# Altium schematic sheet Outputs.SchDoc
size A; SheetNumber: 8; SheetTotal: 10
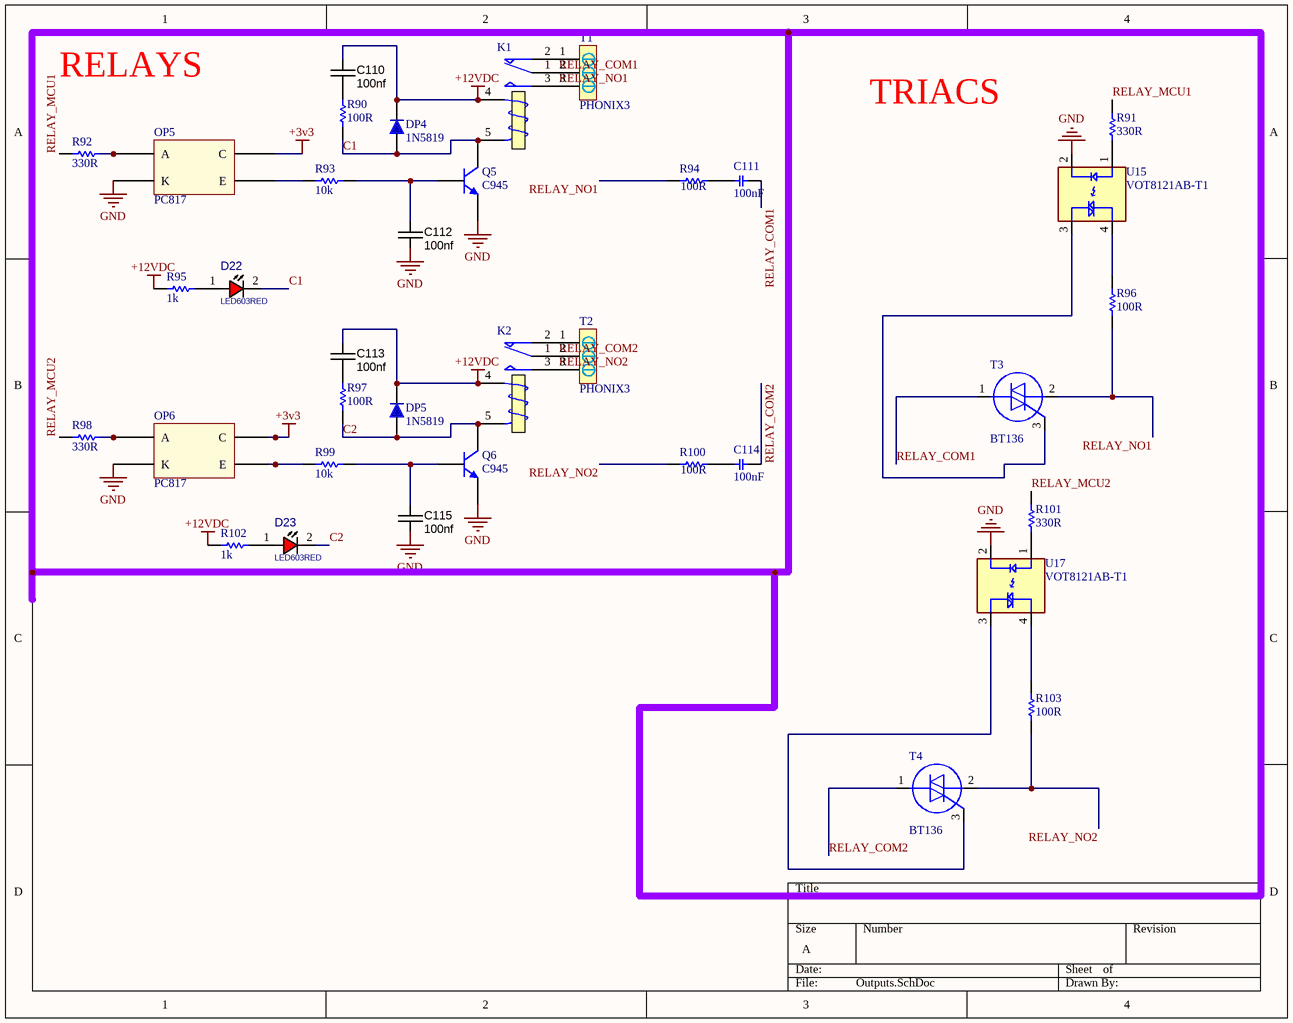
[diagram p0: Outputs.SchDoc]

## Parts
C110  100nf  [CAPC1608X90N]
C111  100nF  [Cap - 10nF - 630V]
C112  100nf  [CAPC1608X90N]
C113  100nf  [CAPC1608X90N]
C114  100nF  [Cap - 10nF - 630V]
C115  100nf  [CAPC1608X90N]
D22  LED603RED  [LED0603RED]
D23  LED603RED  [LED0603RED]
DP4  1N5819  [430X270D]
DP5  1N5819  [430X270D]
K1  (no value)  [Relay 18.85x15.35x15.70]
K2  (no value)  [Relay 18.85x15.35x15.70]
OP5  PC817  [PC817 SMD]
OP6  PC817  [PC817 SMD]
Q5  C945  [SOT23_N]
Q6  C945  [SOT23_N]
R90  100R  [Resistor_SMD_0603 (1608)]
R91  330R  [Resistor_SMD_0603 (1608)]
R92  330R  [Resistor_SMD_0603 (1608)]
R93  10k  [Resistor_SMD_0603 (1608)]
R94  100R  [RES2512]
R95  1k  [Resistor_SMD_0603 (1608)]
R96  100R  [RES2512]
R97  100R  [Resistor_SMD_0603 (1608)]
R98  330R  [Resistor_SMD_0603 (1608)]
R99  10k  [Resistor_SMD_0603 (1608)]
R100  100R  [RES2512]
R101  330R  [Resistor_SMD_0603 (1608)]
R102  1k  [Resistor_SMD_0603 (1608)]
R103  100R  [RES2512]
T1  PHONIX3  [PHONIX3]
T2  PHONIX3  [PHONIX3]
T3  BT136  [TO252]
T4  BT136  [TO252]
U15  VOT8121AB-T1  [SOIC254P1016X440-4N]
U17  VOT8121AB-T1  [SOIC254P1016X440-4N]

## Nets
+3v3: OP5.4(C) OP6.4(C)
+12VDC: C110.2 C113.2 DP4.2 DP5.2 K1.4(T1) K2.4(T1) R95.1 R102.1
GND: C112.1 C115.1 OP5.2(K) OP6.2(K) Q5.2(E) Q6.2(E) U15.2(C) U17.2(C)
C1: D22.2(CATHODE) DP4.1 K1.5(T2) Q5.3(C) R90.2
C2: D23.2(CATHODE) DP5.1 K2.5(T2) Q6.3(C) R97.2
RELAY_COM1: C111.1 K1.1(COM) T1.2 T3.1(MT1)
RELAY_COM2: C114.1 K2.1(COM) T2.2 T4.1(MT1)
RELAY_MCU1: R91.1 R92.1
RELAY_MCU2: R98.1 R101.1
RELAY_NO1: K1.3(NO) R94.2 R96.1 T1.3 T3.2(MT2)
RELAY_NO2: K2.3(NO) R100.2 R103.1 T2.3 T4.2(MT2)
NetC110_1: C110.1 R90.1
NetC111_2: C111.2 R94.1
NetC112_2: C112.2 Q5.1(B) R93.2
NetC113_1: C113.1 R97.1
NetC114_2: C114.2 R100.1
NetC115_2: C115.2 Q6.1(B) R99.2
NetD22_1: D22.1(ANODE) R95.2
NetD23_1: D23.1(ANODE) R102.2
NetK1_2: K1.2(NC) T1.1
NetK2_2: K2.2(NC) T2.1
NetOP5_1: OP5.1(A) R92.2
NetOP5_3: OP5.3(E) R93.1
NetOP6_1: OP6.1(A) R98.2
NetOP6_3: OP6.3(E) R99.1
NetR91_2: R91.2 U15.1(A)
NetR96_2: R96.2 U15.4(MT2)
NetR101_2: R101.2 U17.1(A)
NetR103_2: R103.2 U17.4(MT2)
NetT3_3: T3.3(G) U15.3(MT1)
NetT4_3: T4.3(G) U17.3(MT1)

## Notes on the sheet
- RELAYS
- TRIACS

## Library data of the parts
C110 C112 C113 C115 = CAPC_100n_0603_X7R_50V_10%: Capacitor SMD Cer 100nF 10% 50V X7R 0603; Manufacturer 1: AVX Corporation; Manufacturer Part Number 1: 06035C104KAT2A; Ratings: 50V; X7R; Material: ceramic; SCDType: spec; Value: 100n; Manufacturer 2: TDK Corporation; Manufacturer Part Number 2: C1608X7R1H104K; Package / Case: 0603 (1608 Metric); Tolerance: ±10%; Supplier 1: Digi-Key; Supplier Part Number 1: 478-5052-1-ND; ComponentLink1URL: http://www.avx.com/docs/Catalogs/cx7r.pdf; ComponentLink1Description: http://www.avx.com/docs/Catalogs/cx7r.pdf; Supplier 2: Digi-Key; Supplier Part Number 2: 445-1314-1-ND; ComponentLink2URL: http://product.tdk.com/capacitor/mlcc/en/documents/mlcc_commercial_general_en.pdf; ComponentLink2Description: http://product.tdk.com/capacitor/mlcc/en/documents/mlcc_commercial_general_en.pdf
C111 C114 = Capacitor Polyester THD: DatasheetVersion: 2021; ComponentLink1Description: Website Smart World; ComponentLink1URL: https://www.smartw.ir/; ComponentLink2Description: Telegram; ComponentLink2URL: https://t.me/altium_smartw; ComponentLink3Description: Instagram; ComponentLink3URL: https://Instagram.com/smartgw.ir; Value: 100nF
D22 D23 = LED_SMD_0603_RED: LED, SMD, 0603, RED; PARAM: 30mA, 640nm; DESC: DESCRIPTION; MANF_P#: MANF_PART#; PARAM2: 1.8~2.5V; MANF: MANF; ASSEMBLY: ASSEMBLY; PRICE: PRICE; VALUE: LED603RED
DP4 DP5 = 1N5819: Schottkey Rectifiers; Designer: Abbas Basereh; Data: 16-12-2016; Link: *; Part. No: *
K1 K2 = Relay_SPDT: Single-Pole Dual-Throw Relay; Designer: Abbas Basereh; Mounting Technology: Through-Hole; ComponentLink1Description: Datasheet; Pin Count: 0; Update Date: 2017-3-1
OP5 OP6 = PC817: PC817 optocpler; ComponentLink2Description: Website Smart World; ComponentLink2URL: https://www.smartw.ir/; ComponentLink3Description: Telegram; ComponentLink3URL: https://t.me/altium_smartw; ComponentLink4Description: Instagram; ComponentLink4URL: https://Instagram.com/smartgw.ir; DatasheetVersion: 2021
Q5 Q6 = C945: NPN Silicon Epitaxial Planar Transistor; Published: 2017-2-8; LatestRevisionDate: 2017; LatestRevisionNote: IPC-7351 Footprint Added.; DatasheetVersion: 2017; PackageVersion: 2017-2-8; PackageReference: SOT23; Publisher: Abbas Basereh; PackageDescription: 3-Pin SOT-23 Package 0.95 mm Pitch, 2.3 mm Lead Span; ComponentLink1Description: Manufacturer Link; ComponentLink1URL: http://www.taitroncomponents.com/; ComponentLink2Description: Datasheet; ComponentLink2URL: http://www.taitroncomponents.com/
R90 = Resistor: Resistor 0603; Email: razi.vesali@gmail.com; Value: 10k; Published: 17-Jun-2016; LatestRevisionNote: Re-released for puplic; Publisher: Seyed Razi Vesali
R91 R101 = Resistor: Resistor0603; Email: razi.vesali@gmail.com; Value: 10k; Published: 17-Jun-2016; LatestRevisionNote: Re-released for puplic; Publisher: Seyed Razi Vesali
R92 R95 R97 R98 R102 = Resistor: Email: razi.vesali@gmail.com; Value: 10k; Published: 17-Jun-2016; LatestRevisionNote: Re-released for puplic; Publisher: Seyed Razi Vesali
R93 = Resistor: Resistor 0603; Email: razi.vesali@gmail.com; Published: 17-Jun-2016; LatestRevisionNote: Re-released for puplic; Publisher: Seyed Razi Vesali; Value: 10k
R94 R100 = RES SMD PACKAGE: TOTAL SMD RESISTOR PACK 2512; Designer: Abbas Basereh; Desc.: RES SMD PAKAGES; VALUE: 1K; Data: 2017-3-10
R96 R103 = RES SMD PACKAGE: 2512; Designer: Abbas Basereh; Desc.: RES SMD PAKAGES; VALUE: 1K; Data: 2017-3-10
R99 = Resistor: Email: razi.vesali@gmail.com; Published: 17-Jun-2016; LatestRevisionNote: Re-released for puplic; Publisher: Seyed Razi Vesali; Value: 10k
T3 T4 = BT136X-600E,127: Triac; Manufacturer_Name: WeEn Semiconductors; Datasheet Link: http://www.ween-semi.com/documents/BT136X-600E.pdf?t=636677005870193107; Height: 4.6mm; Manufacturer_Part_Number: BT136X-600E,127; Arrow Part Number: BT136X-600E,127; Arrow Price/Stock: https://www.arrow.com/en/products/bt136x-600e127/ween-semiconductors; Mouser Part Number: 771-BT136X-600E127; Mouser Price/Stock: https://www.mouser.co.uk/ProductDetail/WeEn-Semiconductors/BT136X-600E127?qs=me8TqzrmIYUnGFKHK14Rew%3D%3D
U15 U17 = VOT8121AB-T1: Optoisolator Triac Output 5300Vrms 1 Channel 4-SMD; MF: Vishay Semiconductor Opto Division; SnapEDA_Link: https://www.snapeda.com/parts/VOT8121AB-T1/Vishay/view-part/?ref=snap; Package: SMD-4 Vishay; Value: *; MP: VOT8121AB-T1; Check_prices: https://www.snapeda.com/parts/VOT8121AB-T1/Vishay/view-part/?ref=eda